# EAGLE design THC-schematicRevF (EAGLE 6.4)
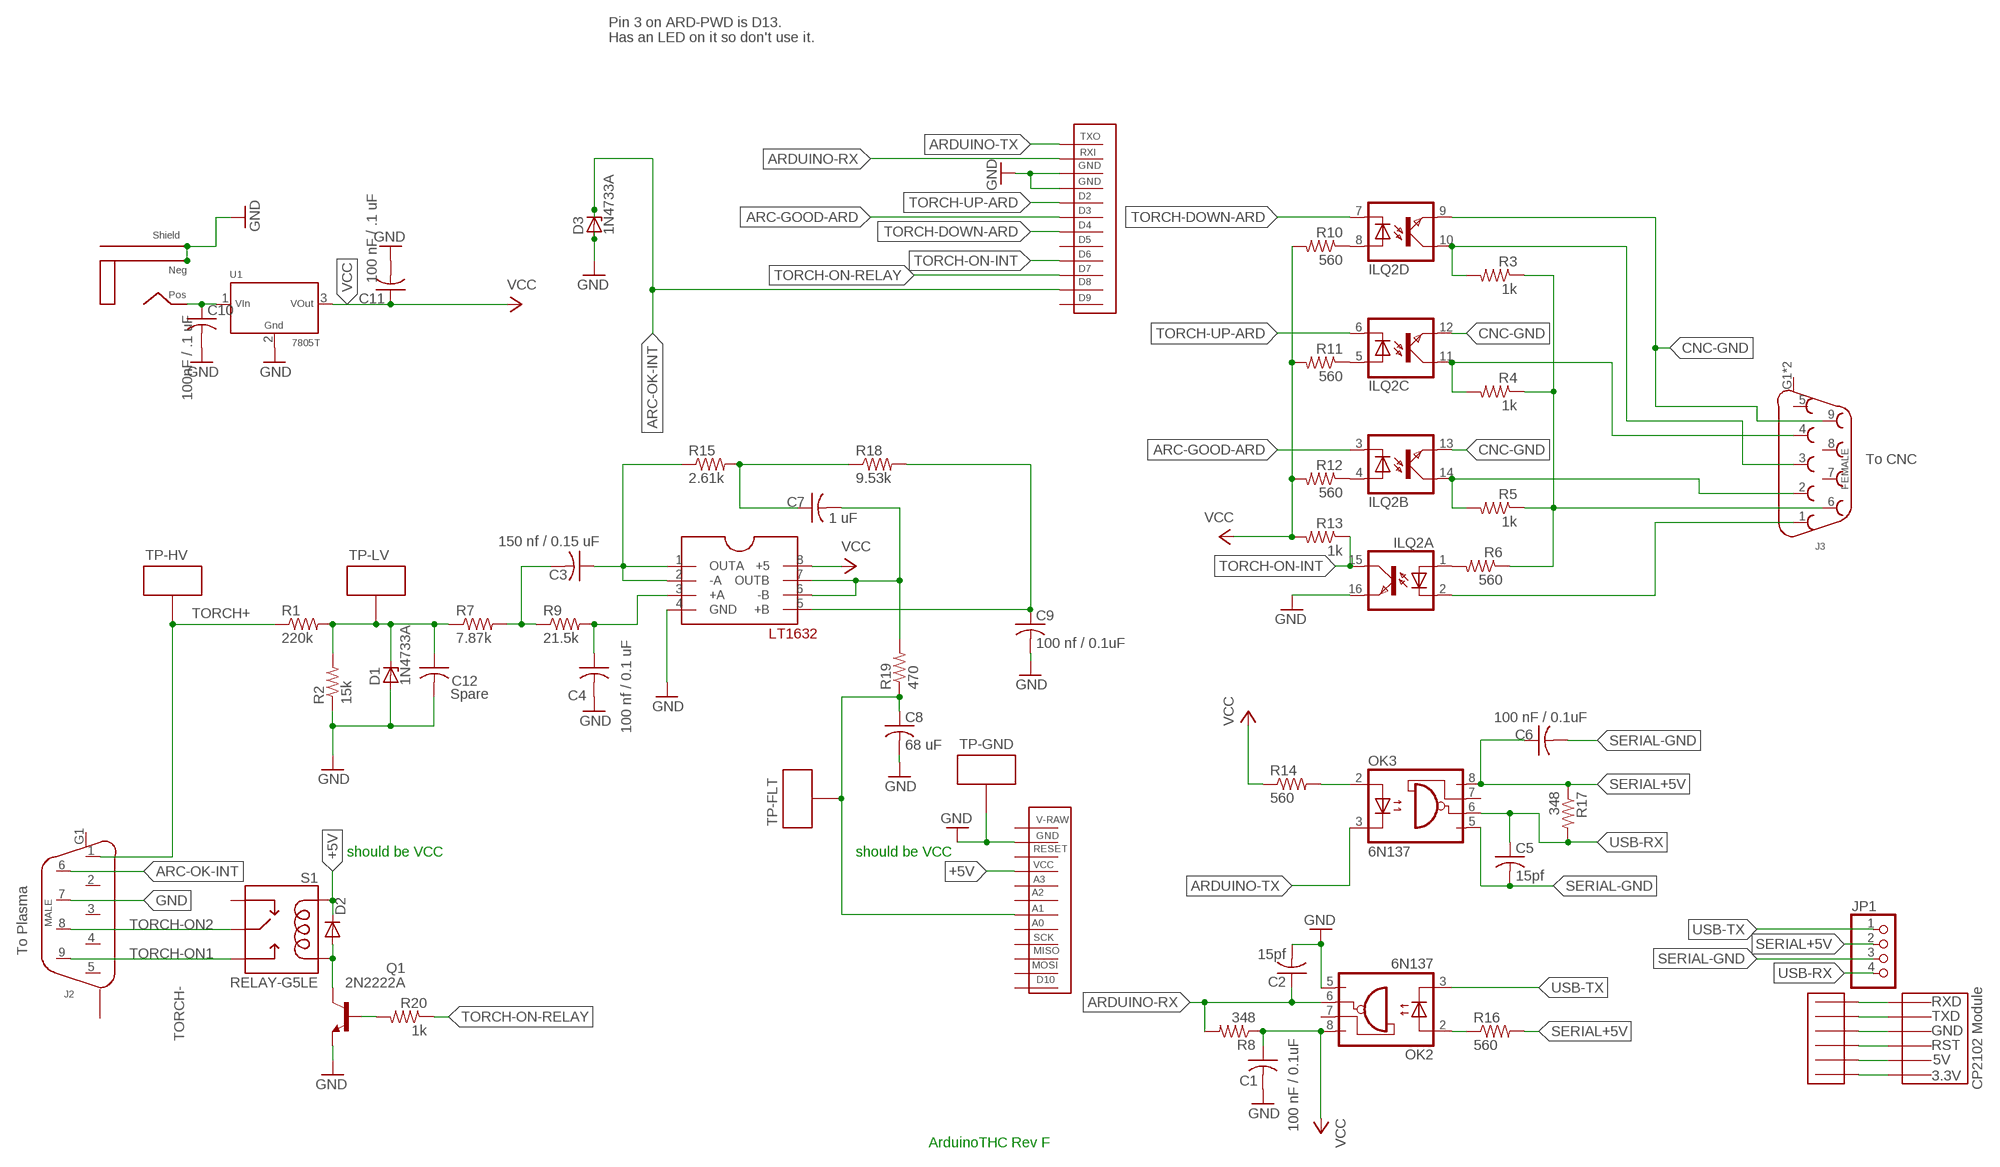
[diagram p0: schematic, sheet 1]

## Parts
C1  100 nF / 0.1uF  C-US025-025X050  [C025-025X050]
C2  15pf  C-US025-025X050  [C025-025X050]
C3  150 nf / 0.15 uF  C-US025-025X050  [C025-025X050]
C4  100 nf / 0.1 uF  C-US025-025X050  [C025-025X050]
C5  15pf  C-US025-025X050  [C025-025X050]
C6  100 nF / 0.1uF  C-US025-025X050  [C025-025X050]
C7  1 uF  C-US025-025X050  [C025-025X050]
C8  68 uF  C-US025-025X050  [C025-025X050]
C9  100 nf / 0.1uF  C-US025-025X050  [C025-025X050]
C10  100nF / .1 uF  C-US025-025X050  [C025-025X050]
C11  100 nF / .1 uF  C-US025-025X050  [C025-025X050]
C12  Spare  C-US025-025X050  [C025-025X050]
D1  1N4733A  ZPY  [DO41Z10]
D2  1N4001  [DO-204AL]
D3  1N4733A  ZPY  [DO41Z10]
ILQ2  ILQ1  [DIL16]
J1  2.1MM-PLUG-PCB-MNT  [2.1MM-PLUG]
J2  DB9-MALE  [DB9M-RIGHT-ANGLE]
J3  DB9-FEMALE  [DB9F-RIGHT-ANGLE]
JP1  PINHD-1X4  [1X04]
MOD1  ARDUINO-PRO-MICRO-FOOTPRINT  [ARDUINO-PRO-MICRO]
OK2  6N137  [DIL08]
OK3  6N137  [DIL08]
Q1  2N2222A  [TO18]
R1  220k  R-US_0207/7  [0207/7]
R2  15k  R-US_0207/7  [0207/7]
R3  1k  R-US_0207/7  [0207/7]
R4  1k  R-US_0207/7  [0207/7]
R5  1k  R-US_0207/7  [0207/7]
R6  560  R-US_0207/7  [0207/7]
R7  7.87k  R-US_0207/7  [0207/7]
R8  348  R-US_0207/7  [0207/7]
R9  21.5k  R-US_0207/7  [0207/7]
R10  560  R-US_0207/7  [0207/7]
R11  560  R-US_0207/7  [0207/7]
R12  560  R-US_0207/7  [0207/7]
R13  1k  R-US_0207/7  [0207/7]
R14  560  R-US_0207/7  [0207/7]
R15  2.61k  R-US_0207/7  [0207/7]
R16  560  R-US_0207/7  [0207/7]
R17  348  R-US_0207/7  [0207/7]
R18  9.53k  R-US_0207/7  [0207/7]
R19  470  R-US_0207/7  [0207/7]
R20  1k  R-US_0207/7  [0207/7]
S1  RELAY-G5LE  [RELAY-G5LE]
TP-FLT  TEST-POINT-.040-HOLE  [TP.040]
TP-GND  TEST-POINT-.040-HOLE  [TP.040]
TP-HV  TEST-POINT-.040-HOLE  [TP.040]
TP-LV  TEST-POINT-.040-HOLE  [TP.040]
U1  7805T  [TO-220-3]
U$1  LT1632  [DIP08]
U$2  CP2102-TTL-USB  [CP2102]
U$3  CP2102-PADS  [CP2102-PADS]

## Nets
+5V: D2.C MOD1.P$VCC(VCC) S1.P$5-COIL(COIL-2)
ARC-GOOD-ARD: ILQ2.3(B:C) MOD1.P$D3(D3)
ARC-OK-INT: D3.C J2.6 MOD1.P$D8(D8)
ARD-ANALOG-IN: C8.1 MOD1.P$A1(A1) R19.1 TP-FLT.P$1
ARDUINO-RX: C2.1 MOD1.P$RXI(RXI) OK2.6(VO) R8.2
ARDUINO-TX: MOD1.P$TX0(TX0) OK3.3(C)
CNC+5: J3.6 R3.1 R4.1 R5.1 R6.1
CNC-ARC-GOOD: ILQ2.14(B:COL) J3.2 R5.2
CNC-GND: ILQ2.9(D:EMIT) ILQ2.12(C:EMIT) ILQ2.13(B:EMIT) J3.9
CNC-TORCH-DOWN: ILQ2.10(D:COL) J3.3 R3.2
CNC-TORCH-ON: ILQ2.2(A:C) J3.1
CNC-TORCH-UP: ILQ2.11(C:COL) J3.4 R4.2
DIVIDER: C12.1 D1.C R1.2 R2.2 R7.1 TP-LV.P$1
GND: C1.2 C2.2 C4.2 C8.2 C9.2 C10.2 C11.2 C12.2 D1.A D3.A ILQ2.16(A:EMIT) J1.P$NEG J1.P$SHLD J2.7 MOD1.P$GND-2(GND2) MOD1.P$GND-9(GND9) MOD1.P$GND-10(GND10) OK2.5(GND) Q1.1(E) R2.1 TP-GND.P$1 U1.2(GND) U$1.4(GND)
N$1: C10.1 J1.P$POS U1.1(VIN)
N$2: ILQ2.4(B:A) R12.1
N$3: D2.A Q1.3(C) S1.P$2-COIL(COIL-1)
N$4: Q1.2(B) R20.2
N$6: U$2.P$3.3V U$3.P$6(P$3.3V)
N$7: ILQ2.5(C:A) R11.1
N$8: ILQ2.8(D:A) R10.1
N$9: ILQ2.1(A:A) R6.2
N$10: U$2.P$RST U$3.P$5(P$RST)
N$11: U$2.P$TXD U$3.P$4(P$TXD)
N$12: U$2.P$RXD U$3.P$3(P$RXD)
N$13: U$2.P$GND U$3.P$2(P$GND)
N$14: U$2.P$5V U$3.P$1(P$5V)
N$26: C3.2 R7.2 R9.1
N$27: C4.1 R9.2 U$1.3(+A)
N$29: C3.1 R15.1 U$1.1(OUTA) U$1.2(-A)
N$30: C7.1 R15.2 R18.1
N$31: C9.1 R18.2 U$1.5(+B)
N$32: OK3.2(A) R14.2
N$34: OK2.2(A) R16.1
SERIAL+5V: C6.1 JP1.2 OK3.8(VCC) R16.2 R17.1
SERIAL-GND: C5.2 C6.2 JP1.3 OK3.5(GND)
TORCH+: J2.1 R1.1 TP-HV.P$1
TORCH-DOWN-ARD: ILQ2.7(D:C) MOD1.P$D4(D4)
TORCH-ON1: J2.9 S1.P$4-NO(NO)
TORCH-ON2: J2.8 S1.P$1-COMMON(COM)
TORCH-ON-INT: ILQ2.15(A:COL) MOD1.P$D6(D6) R13.1
TORCH-ON-RELAY: MOD1.P$D7(D7) R20.1
TORCH-UP-ARD: ILQ2.6(C:C) MOD1.P$D2(D2)
UNFILTERED: C7.2 R19.2 U$1.6(-B) U$1.7(OUTB)
USB-RX: C5.1 JP1.4 OK3.6(VO) R17.2
USB-TX: JP1.1 OK2.3(C)
VCC: C1.1 C11.1 OK2.8(VCC) R8.1 R10.2 R11.2 R12.2 R13.2 R14.1 U1.3(VOUT) U$1.8(+5)
Unconnected: J2.2 J2.3 J2.4 J2.5 J2.G1(P$SHLD) J2.G2(SHLD2) J3.5 J3.7 J3.8 J3.G1(P$SHLD) J3.G2(P$SHLD) MOD1.P$A0(A0) MOD1.P$A2(A2) MOD1.P$A3(A3) MOD1.P$D5(D5) MOD1.P$D9(D9) MOD1.P$D10(D10) MOD1.P$MISO(MISO) MOD1.P$MOSI(MOSI) MOD1.P$RESET(RESET) MOD1.P$SCK(SCK) MOD1.P$V-RAW(V-RAW) OK2.7(VE) OK3.7(VE) S1.P$3-NC(NC)

## Notes on the sheet
- Pin 3 on ARD-PWD is D13.
  Has an LED on it so don't use it.
- To CNC
- TORCH+
- should be VCC | should be VCC
- To Plasma
- TORCH-
- ArduinoTHC Rev F

## Library data of the parts
C1-C12 = resistor:C-US: CAPACITOR, American symbol
D1 D3 = diode:ZPY: Z DIODE 1 W
D2 = DIODE-1N4001:1N4001
ILQ2 = optocoupler:ILQ1: SIEMENS OPTO COUPLER; MF: VISHAY/TELEFUNKEN; MPN: ILQ1; OC_FARNELL: 1469501; OC_NEWARK: 88K1954
J1 = ArdunioPowerJack:2.1MM-PLUG-PCB-MNT
J2 = DB-9Male-Rangle-RMG:DB9-MALE
J3 = DB-9Male-Rangle-RMG:DB9-FEMALE
JP1 = pinhead:PINHD-1X4: PIN HEADER
MOD1 = ArduinoProMicro:ARDUINO-PRO-MICRO-FOOTPRINT
OK2 OK3 = optocoupler:6N137: MOTOROLA OPTO COUPLER; MPN: 6N137; OC_FARNELL: 1328376; OC_NEWARK: 52M1895
Q1 = transistor-npn:2N2222*: NPN Transistor
R1-R20 = resistor:R-US_: RESISTOR, American symbol
S1 = RELAY-G5LE:RELAY-G5LE
TP-FLT TP-GND TP-HV TP-LV = TestPoint:TEST-POINT-.040-HOLE
U1 = 7805Regulator-RMG:7805T
U$1 = ArduinoThcOpAmp:LT1632
U$2 = CP2102 TTL to USB:CP2102-TTL-USB
U$3 = CP2102 TTL to USB:CP2102-PADS

## Board
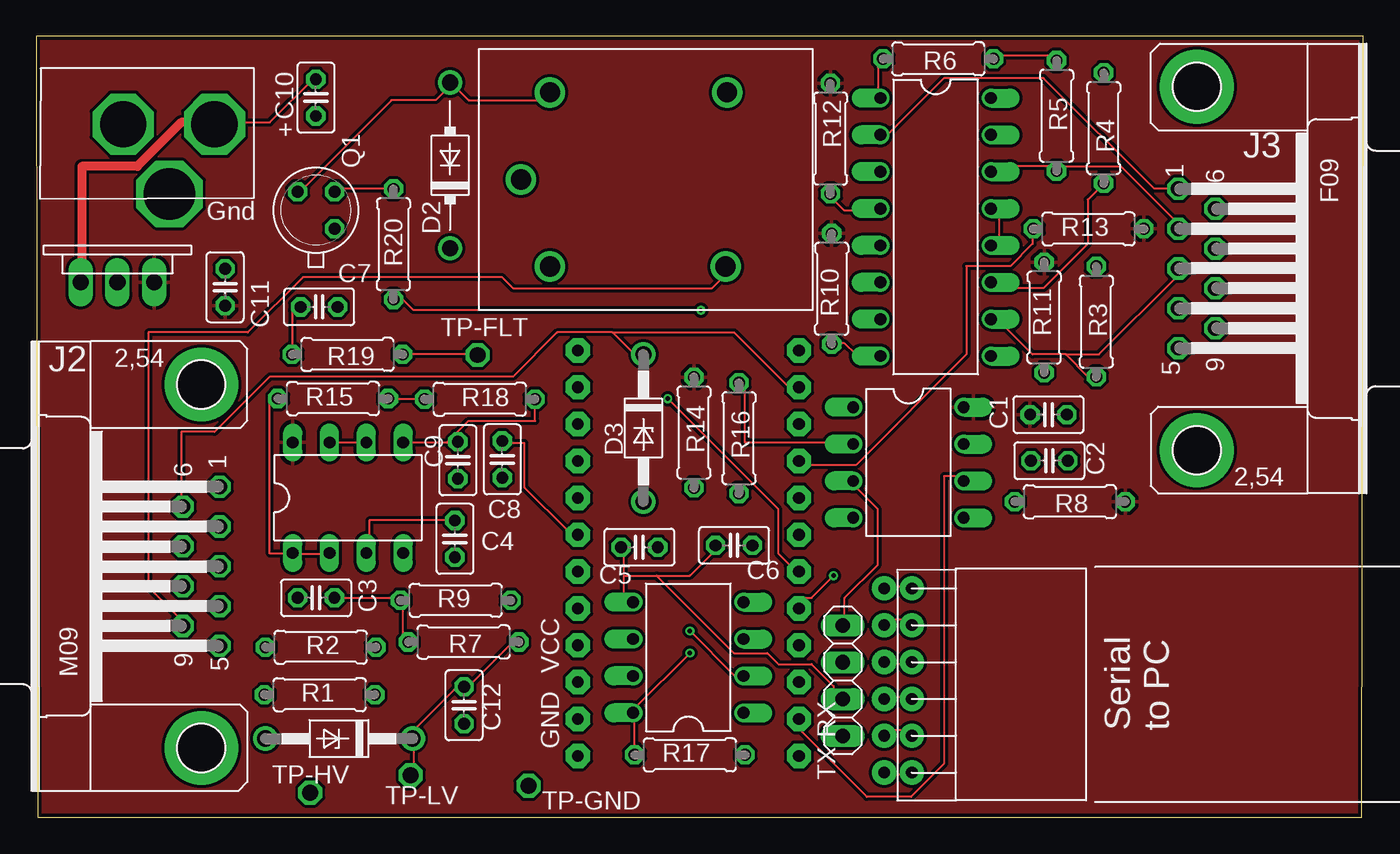
[diagram p1: board, top side]
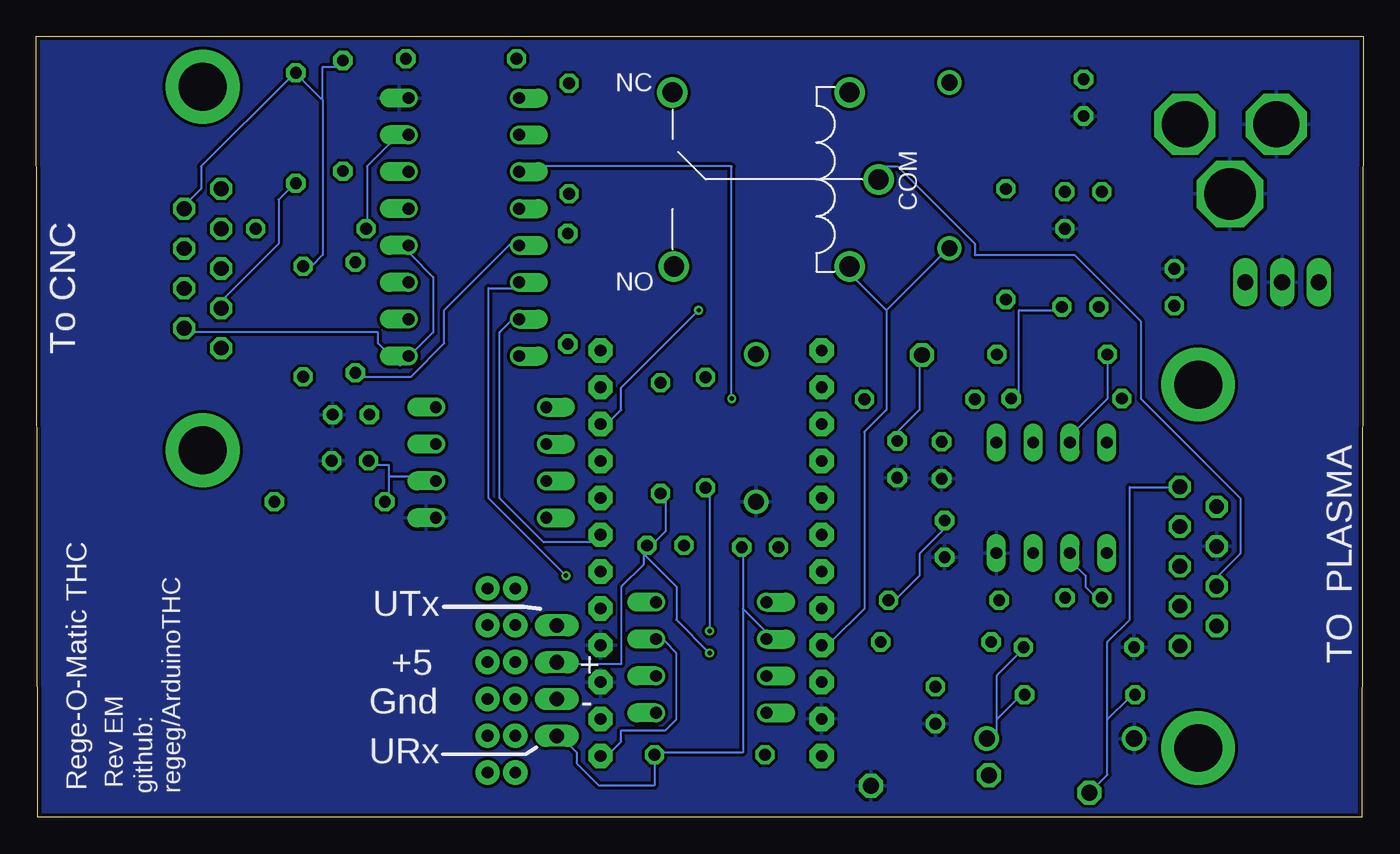
[diagram p2: board, bottom side, seen from below]

Size 91.47 x 53.83 mm. Coordinates in mm from the lower left corner, seen from the top.
Outline: 0.1,0 91.37,0.03 91.47,53.83 0,53.83 0.1,0
Copper layers (1*16): Top 0.035mm / dielectric 1.5mm / Bottom 0.035mm
Design rules "Seeed Studio - Fusion_eagle_rule_v1.1 *": minimum track width 6mil, minimum drill 12mil, track to track 8mil, track to pad 8mil, pad to pad 6mil, via to via 6mil, smd to smd 0mil, copper to edge 10mil, drill to drill 10mil, minimum pad ring 10mil, minimum via ring 6mil, stop-mask expansion 2mil, vias tented up to drill 100mil, thermal gap 10mil

### Footprints (pad centres in the part's own frame; a part is rotated, then mirrored left to right if it is on the bottom)
C025-025X050 = drill 0.813 octagon: 1 -1.27,0; 2 1.27,0
DO41Z10 = drill 1.118: A 5.08,0; C -5.08,0
DO-204AL = drill 1.118: A 5.08,0; C -6.35,0
DIL16 = drill 0.813 offset: 1 -8.89,-3.81; 2 -6.35,-3.81; 3 -3.81,-3.81; 4 -1.27,-3.81; 5 1.27,-3.81; 6 3.81,-3.81; 7 6.35,-3.81; 8 8.89,-3.81; 9 8.89,3.81; 10 6.35,3.81; 11 3.81,3.81; 12 1.27,3.81; 13 -1.27,3.81; 14 -3.81,3.81; 15 -6.35,3.81; 16 -8.89,3.81
2.1MM-PLUG = drill 3.2 octagon: P$NEG -6.3,0; P$POS 0,0 | drill 3.556 octagon: P$SHLD -3.1,-4.8
DB9M-RIGHT-ANGLE = drill 1.016 octagon: 1 5.486,-1.27; 2 2.743,-1.27; 3 0,-1.27; 4 -2.743,-1.27; 5 -5.486,-1.27; 6 4.115,1.27; 7 1.372,1.27; 8 -1.372,1.27; 9 -4.115,1.27 | drill 3.302 pad 5.08: G1 -12.522,0; G2 12.522,0
DB9F-RIGHT-ANGLE = drill 1.016 octagon: 1 -5.486,-10.16; 2 -2.743,-10.16; 3 0,-10.16; 4 2.743,-10.16; 5 5.486,-10.16; 6 -4.115,-7.62; 7 -1.372,-7.62; 8 1.372,-7.62; 9 4.115,-7.62 | drill 3.302 pad 5.08: G1 -12.522,-8.89; G2 12.522,-8.89
1X04 = drill 1.016 long: 1 -3.81,0; 2 -1.27,0; 3 1.27,0; 4 3.81,0
ARDUINO-PRO-MICRO = drill 0.8 pad 1.676 octagon: P$A0 7.62,-2.54; P$A1 7.62,0; P$A2 7.62,2.54; P$A3 7.62,5.08; P$D2 -7.62,5.08; P$D3 -7.62,2.54; P$D4 -7.62,0; P$D5 -7.62,-2.54; P$D6 -7.62,-5.08; P$D7 -7.62,-7.62; P$D8 -7.62,-10.16; P$D9 -7.62,-12.7; P$D10 7.62,-12.7; P$GND-2 7.62,12.7; P$GND-9 -7.62,7.62; P$GND-10 -7.62,10.16; P$MISO 7.62,-7.62; P$MOSI 7.62,-10.16; P$RESET 7.62,10.16; P$RXI -7.62,12.7; P$SCK 7.62,-5.08; P$TX0 -7.62,15.24; P$V-RAW 7.62,15.24; P$VCC 7.62,7.62
DIL08 = drill 0.813 offset: 1 -3.81,-3.81; 2 -1.27,-3.81; 3 1.27,-3.81; 4 3.81,-3.81; 5 3.81,3.81; 6 1.27,3.81; 7 -1.27,3.81; 8 -3.81,3.81
TO18 = drill 0.813 octagon: 1 -1.27,-1.27; 2 1.27,-1.27; 3 1.27,1.27
0207/7 = drill 0.813 octagon: 1 -3.81,0; 2 3.81,0
RELAY-G5LE = drill 1.4: P$1-COMMON -8.1,0; P$2-COIL -6.1,6; P$3-NC 6.1,6; P$4-NO 6,-6; P$5-COIL -6.1,-6
TP.040 = drill 1.1 octagon: P$1 0,0
TO-220-3 = drill 1.118 long: 1 -2.54,0; 2 0,0; 3 2.54,0
DIP08 = drill 0.813 long: 1 -2.54,-3.81; 2 0,-3.81; 3 2.54,-3.81; 4 5.08,-3.81; 5 5.08,3.81; 6 2.54,3.81; 7 0,3.81; 8 -2.54,3.81
CP2102 = drill 0.8 pad 1.676: P$3.3V -12,-6.08; P$5V -12,6.62; P$GND -12,4.08; P$RST -12,-3.54; P$RXD -12,1.54; P$TXD -12,-1
CP2102-PADS = drill 0.8 pad 1.676: P$1 -0.57,7.636; P$2 -0.57,5.096; P$3 -0.57,2.556; P$4 -0.57,0.016; P$5 -0.57,-2.524; P$6 -0.57,-5.064

### Placement (x,y rotation side)
C1  69.78,27.76 0 top
C2  69.84,24.59 0 top
C3  19.29,15.14 0 top
C4  28.86,19.2 270 top
C5  41.57,18.62 180 top
C6  48.1,18.75 180 top
C7  19.5,35.18 180 top
C8  32.12,24.67 270 top
C9  29.06,24.62 270 top
C10  19.27,49.61 270 top
C11  13.02,36.54 90 top
C12  29.48,7.73 270 top
D1  20.87,5.44 180 top
D2  28.52,45.57 90 top
D3  41.85,26.84 270 top
ILQ2  62,40.69 270 top
J1  12.29,47.77 0 top
J2  11.38,17.31 90 top
J3  88.89,37.83 270 top
JP1  55.6,9.43 270 top
MOD1  44.96,19.48 180 top
OK2  60.12,24.46 270 top
OK3  44.95,11.03 90 top
Q1  19.29,41.85 90 top
R1  19.54,8.46 0 top
R2  19.61,11.74 0 top
R3  73.07,34.17 270 top
R4  73.58,47.51 270 top
R5  70.33,48.35 270 top
R6  62.18,52.27 180 top
R7  29.46,12.09 180 top
R8  71.25,21.76 180 top
R9  28.91,14.96 0 top
R10  54.83,36.43 90 top
R11  69.48,34.45 90 top
R12  54.75,46.78 90 top
R13  72.54,40.56 0 top
R14  45.33,26.53 270 top
R15  20.46,28.86 0 top
R16  48.44,26.14 270 top
R17  45.05,4.32 0 top
R18  30.57,28.83 0 top
R19  21.45,31.91 180 top
R20  24.62,39.5 90 top
S1  41.52,43.97 0 top
TP-FLT  30.41,31.87 0 top
TP-GND  33.93,2.17 180 top
TP-HV  18.88,1.71 270 top
TP-LV  25.81,2.92 0 top
U1  5.6,36.88 0 top
U$1  20.21,22.03 0 top
U$2  72.36,9.17 0 top
U$3  59.03,8.16 0 top

### Tracks (layer width: path | path; a pad name or v marks a point on that pad's centre or on a via)
+5V
  Bottom 0.152: 32.87,34.95 32.87,28.09 34.39,26.57 34.39,14.38 36.68,12.09 MOD1.P$VCC | 32.87,34.95 35.15,37.24 S1.P$5-COIL | 32.87,34.95 29.06,38.76 D2.C
ARC-GOOD-ARD  (via drill 0.3)
  Top 0.152: v43.53,28.86 51.15,21.24 51.15,18.19 51.92,17.43 MOD1.P$D3
  Bottom 0.152: v43.53,28.86 43.53,44.86 58.01,44.86 ILQ2.3
ARC-OK-INT
  Top 0.152: 39.72,33.43 35.91,33.43 32.87,30.38 16.1,30.38 12.29,26.57 10.01,26.57 10.01,22 J2.6 | 39.72,33.43 41.25,31.9 D3.C | 39.72,33.43 48.11,33.43 51.92,29.62 MOD1.P$D8
ARD-ANALOG-IN
  Top 0.152: R19.1 25.25,31.9 29.82,31.9 TP-FLT.P$1 | MOD1.P$A1 36.68,19.71 33.63,22.76 33.63,25.81 32.1,25.81 C8.1
  Bottom 0.152: C8.1 32.1,26.57 30.58,28.09 30.58,31.14 TP-FLT.P$1
ARDUINO-RX
  Top 0.152: MOD1.P$RXI 52.68,6.76 52.68,6 57.25,1.42 60.3,1.42 62.58,3.71 62.58,23.52 63.35,23.52 OK2.6
  Bottom 0.152: 67.16,23.52 64.11,23.52 OK2.6 | 67.16,23.52 67.16,22 R8.2 | 67.16,23.52 67.16,24.28 68.68,24.28 C2.1
ARDUINO-TX
  Bottom 0.152: OK3.3 48.11,12.09 47.34,11.33 47.34,6.76 48.11,6 51.15,6 51.15,5.23 51.92,4.47 MOD1.P$TX0
CNC+5
  Top 0.152: R6.1 66.39,52.48 70.2,52.48 R5.1
  Bottom 0.152: 71.73,49.43 71.73,38.76 72.49,38 R3.1 | 71.73,49.43 73.25,50.95 R4.1 74.01,50.95 80.11,44.86 80.11,43.33 80.87,42.57 J3.6 | 71.73,49.43 71.73,51.72 70.2,51.72 R5.1
CNC-ARC-GOOD
  Top 0.152: 70.2,44.86 66.39,44.86 ILQ2.14 | 70.2,44.86 74.78,44.86 78.59,41.05 J3.2 | 70.2,44.86 R5.2
CNC-GND
  Top 0.152: ILQ2.13 66.39,41.81 66.39,39.52 ILQ2.12
  Bottom 0.152: ILQ2.12 65.63,38.76 64.11,37.24 64.11,33.43 65.63,31.9 ILQ2.9 66.39,31.14 67.92,32.67 67.92,33.43 80.87,33.43 J3.9
CNC-TORCH-DOWN
  Top 0.152: 70.97,31.9 68.68,31.9 66.39,34.19 ILQ2.10 | 70.97,31.9 72.49,30.38 R3.2 | 70.97,31.9 73.25,31.9 78.59,37.24 J3.3
CNC-TORCH-ON
  Top 0.152: ILQ2.2 58.77,47.14 62.58,50.95 69.44,50.95 77.06,43.33 78.59,43.33 J3.1
CNC-TORCH-UP
  Top 0.152: ILQ2.11 66.39,36.48 69.44,36.48 72.49,39.52 72.49,42.57 73.25,43.33 R4.2
  Bottom 0.152: J3.4 78.59,35.71 74.78,39.52 74.78,42.57 74.01,43.33 R4.2
DIVIDER
  Top 0.152: R7.1 32.87,12.09 29.82,9.04 C12.1 29.06,9.04 26.01,6 D1.C 26.01,5.23 26.01,2.95 TP-LV.P$1
  Bottom 0.152: 25.25,6.76 23.72,8.28 R1.2 | 25.25,6.76 25.25,5.23 D1.C | 25.25,6.76 25.25,9.81 23.72,11.33 R2.2
GND
  pour Bottom: -0.03,53.83 0.12,0 91.31,0.28 91.46,53.83
N$1
  Top 0.152: C10.1 19.15,50.95 16.1,47.91 12.29,47.91 J1.P$POS | 3.15,37.24 U1.1
  Top 0.61: 3.15,37.24 3.15,44.86 6.96,44.86 10.01,47.91 12.29,47.91
N$2
  Top 0.152: R12.1 54.96,42.57 55.73,41.81 58.01,41.81 ILQ2.4
N$3
  Top 0.152: Q1.3 18.39,43.33 24.48,49.43 27.53,49.43 28.29,50.19 D2.A 29.06,50.19 29.82,49.43 35.15,49.43 S1.P$2-COIL
N$4
  Top 0.152: Q1.2 20.67,43.33 24.48,43.33 R20.2
N$6
  Top 0.152: U$3.P$6 58.77,2.95 60.3,2.95 U$2.P$3.3V
N$7
  Bottom 0.152: ILQ2.5 58.77,39.52 63.35,34.95 63.35,32.67 65.63,30.38 69.44,30.38 R11.1
N$8
  Top 0.152: R10.1 54.96,32.67 55.73,32.67 56.49,31.9 58.01,31.9 ILQ2.8
N$9
  Top 0.152: ILQ2.1 58.01,50.19 58.01,51.72 R6.2
N$10
  Top 0.152: U$3.P$5 58.77,6 60.3,6 U$2.P$RST
N$11
  Top 0.152: U$3.P$4 58.77,8.28 60.3,8.28 U$2.P$TXD
N$12
  Top 0.152: U$3.P$3 58.77,10.57 60.3,10.57 U$2.P$RXD
N$13
  Top 0.152: U$3.P$2 58.77,13.62 60.3,13.62 U$2.P$GND
N$14
  Top 0.152: U$3.P$1 58.77,15.9 60.3,15.9 U$2.P$5V
N$26
  Top 0.152: C3.2 20.67,15.14 24.48,15.14 R9.1 25.25,14.38 25.25,12.09 R7.2
N$27
  Top 0.152: U$1.3 22.96,18.95 22.96,20.47 28.29,20.47 C4.1
  Bottom 0.152: R9.2 32.1,15.14 30.58,16.66 30.58,18.19 29.06,19.71 29.06,20.47 C4.1
N$29
  Top 0.152: 17.63,18.19 16.1,18.19 16.1,28.86 R15.1 | 17.63,18.19 19.91,18.19 U$1.2 | 17.63,18.19 U$1.1
  Bottom 0.152: C3.1 18.39,15.14 19.15,15.9 19.15,16.66 19.91,17.43 19.91,18.19 U$1.2
N$30
  Top 0.152: R18.1 26.77,28.86 24.48,28.86 R15.2
  Bottom 0.152: C7.1 20.67,34.95 23.72,34.95 23.72,28.86 R15.2
N$31
  Top 0.152: 28.29,25.81 29.06,25.81 C9.1 | 28.29,25.81 25.25,25.81 U$1.5 | 28.29,25.81 29.82,27.33 34.39,27.33 34.39,28.86 R18.2
N$32  (via drill 0.3)
  Top 0.152: v45.06,12.85 48.11,9.81 OK3.2
  Bottom 0.152: v45.06,12.85 45.06,22.76 R14.2
N$34
  Top 0.152: R16.1 48.87,29.62 48.87,25.81 55.73,25.81 OK2.2
SERIAL+5V  (via drill 0.3)
  Top 0.152: R17.1 41.25,4.47 41.25,6.76 OK3.8 41.25,7.52 v45.06,11.33
  Bottom 0.152: R16.2 48.11,22 48.11,19.71 48.87,18.95 C6.1 49.63,18.19 | 49.63,18.19 49.63,17.43 51.15,15.9 51.15,10.57 54.96,10.57 JP1.2 | v45.06,11.33 47.34,13.62 47.34,15.9 49.63,18.19
SERIAL-GND
  Top 0.152: 40.49,16.66 40.49,18.19 C5.2 | 40.49,16.66 40.49,15.14 OK3.5 | 40.49,16.66 42.77,16.66 | 42.77,16.66 45.06,16.66 46.58,18.19 C6.2 | 42.77,16.66 48.11,11.33 50.39,11.33 51.15,10.57 53.44,10.57 54.96,9.04 54.96,8.28 JP1.3
TORCH+
  Bottom 0.152: 17.63,6.76 16.1,8.28 R1.1 | 17.63,6.76 17.63,2.95 18.39,2.19 TP-HV.P$1 | 17.63,6.76 17.63,12.09 16.1,13.62 16.1,22.76 13.05,22.76 J2.1
TORCH-DOWN-ARD
  Bottom 0.152: ILQ2.7 58.77,34.19 59.54,33.43 59.54,22 56.49,18.95 52.68,18.95 MOD1.P$D4
TORCH-ON1
  Top 0.152: J2.9 10.01,13.62 7.72,15.9 7.72,33.43 14.58,33.43 18.39,37.24 32.1,37.24 32.87,36.48 46.58,36.48 47.34,37.24 S1.P$4-NO
TORCH-ON2
  Bottom 0.152: J2.8 10.01,16.66 8.48,18.19 8.48,22 15.34,28.86 15.34,34.19 19.91,38.76 26.77,38.76 26.77,39.52 32.1,44.86 33.63,44.86 33.63,44.1 S1.P$1-COMMON
TORCH-ON-INT
  Top 0.152: MOD1.P$D6 52.68,24.28 56.49,24.28 64.11,31.9 64.11,38 67.16,38 68.68,39.52 68.68,40.29 R13.1
  Bottom 0.152: R13.1 68.68,41.05 68.68,44.86 66.39,47.14 ILQ2.15
TORCH-ON-RELAY  (via drill 0.3)
  Top 0.152: v45.82,34.95 26.01,34.95 25.25,35.71 R20.1
  Bottom 0.152: v45.82,34.95 51.15,29.62 51.15,28.09 51.92,27.33 MOD1.P$D7
TORCH-UP-ARD  (via drill 0.3)
  Top 0.152: v54.96,16.66 53.44,15.14 52.68,15.14 MOD1.P$D2
  Bottom 0.152: v54.96,16.66 60.3,22 60.3,36.48 58.01,36.48 ILQ2.6
UNFILTERED
  Top 0.152: U$1.7 20.67,25.81 22.2,25.81 U$1.6 | R19.2 17.63,31.9 17.63,34.95 C7.2
  Bottom 0.152: U$1.7 19.91,26.57 17.63,28.86 17.63,31.9 R19.2
USB-RX
  Bottom 0.152: 42.77,14.38 41.25,12.85 OK3.6 | 42.77,14.38 42.77,18.19 C5.1 | 42.77,14.38 42.77,4.47 48.87,4.47 R17.2 48.87,3.71 48.87,2.19 52.68,2.19 54.2,3.71 54.2,4.47 54.96,5.23 JP1.4
USB-TX
  Top 0.152: OK2.3 56.49,22.76 58.01,21.24 58.01,17.43 55.73,15.14 55.73,13.62 JP1.1
VCC
  pour Top: -0.03,53.83 0.12,0 91.31,0.28 91.46,53.83

### Text on the board
bPlace: To CNC | Rev EM | github: / regeg/ArduinoTHC | Rege-O-Matic THC
tNames: Serial / to PC
bNames: TO PLASMA | UTx | + | +5 | - | Gnd | URx